# Altium schematic sheet Microcontroller.SchDoc
size A2
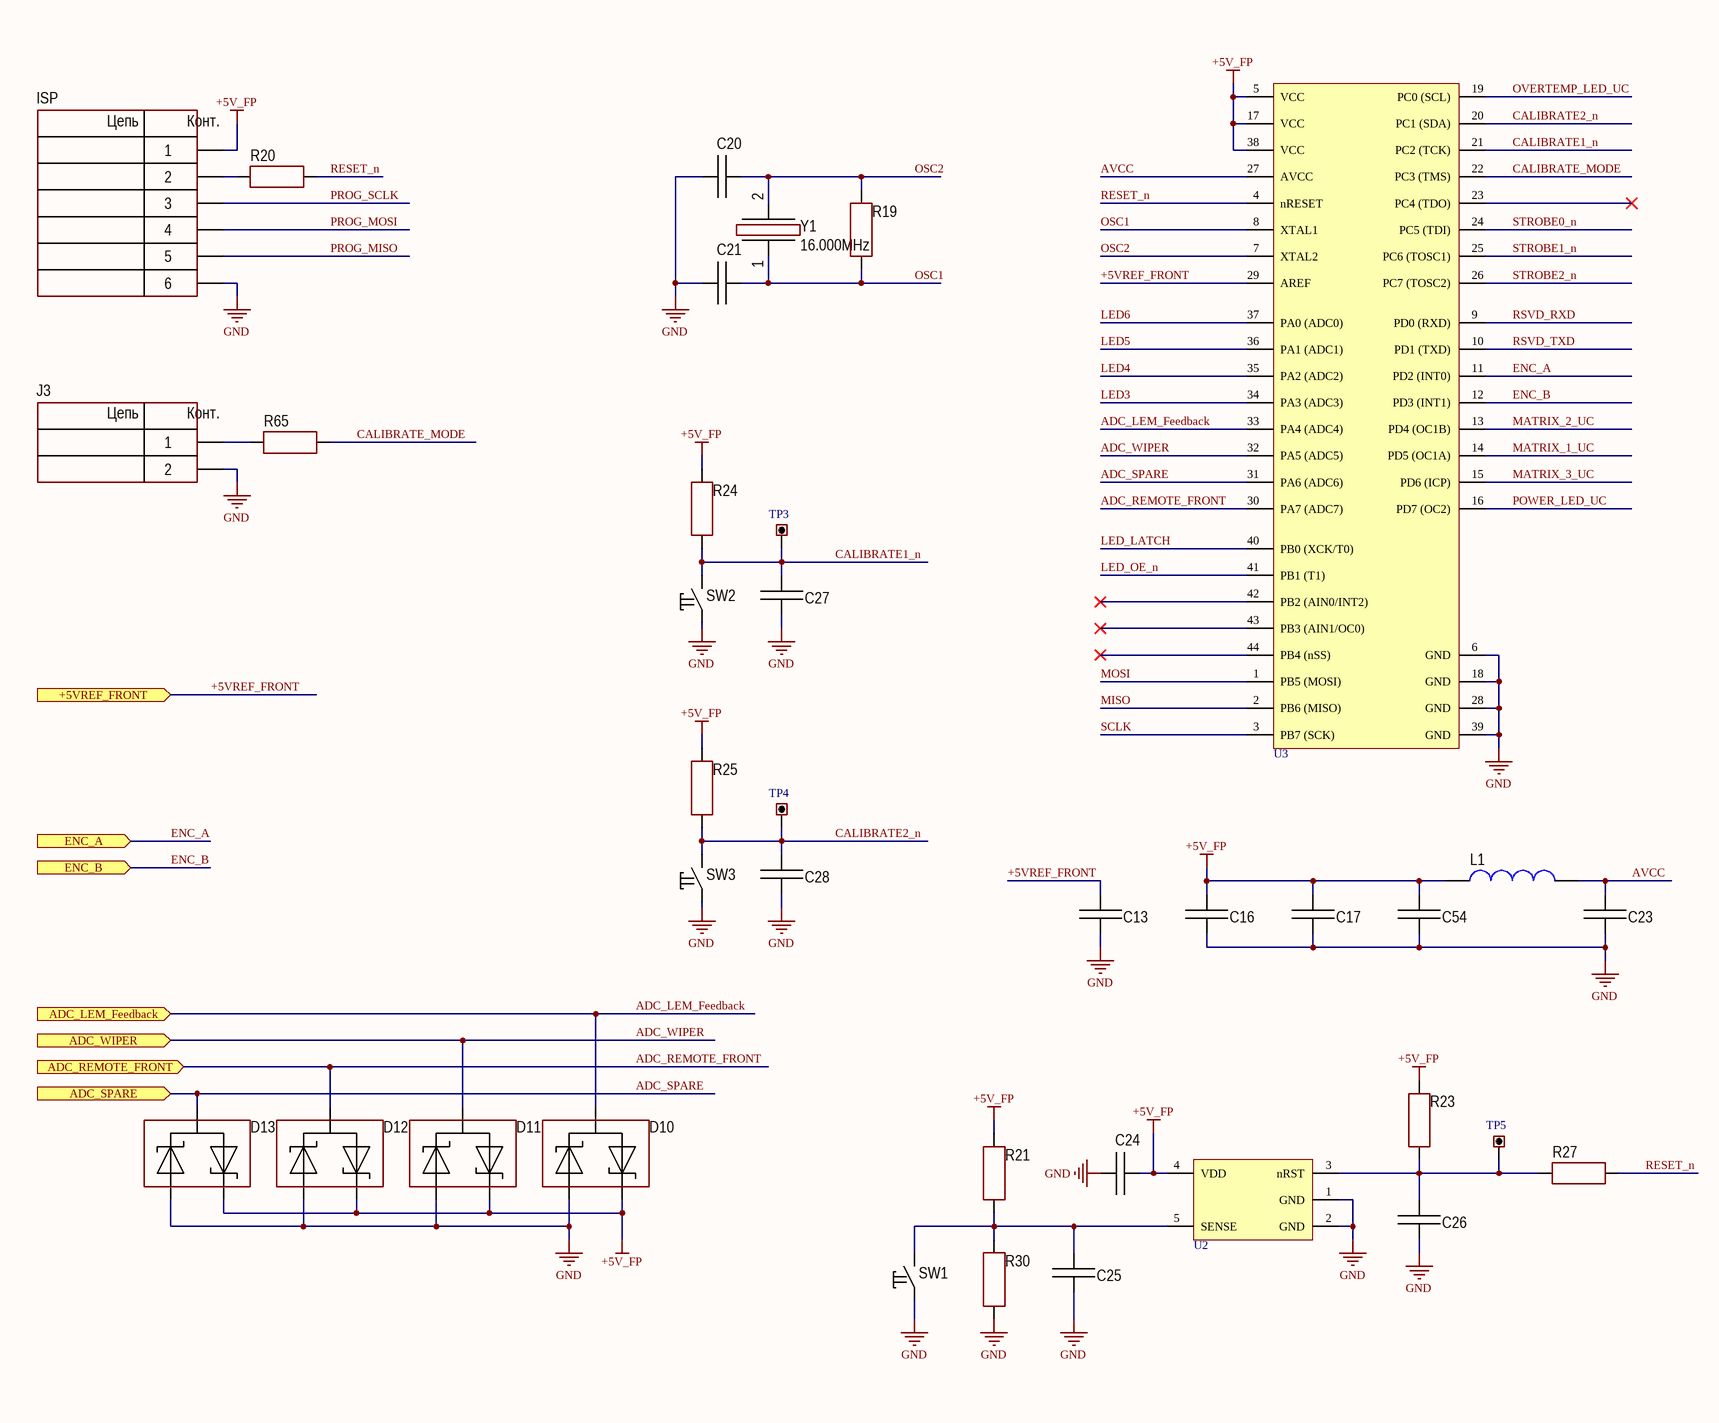
[diagram p0: Microcontroller.SchDoc, left]
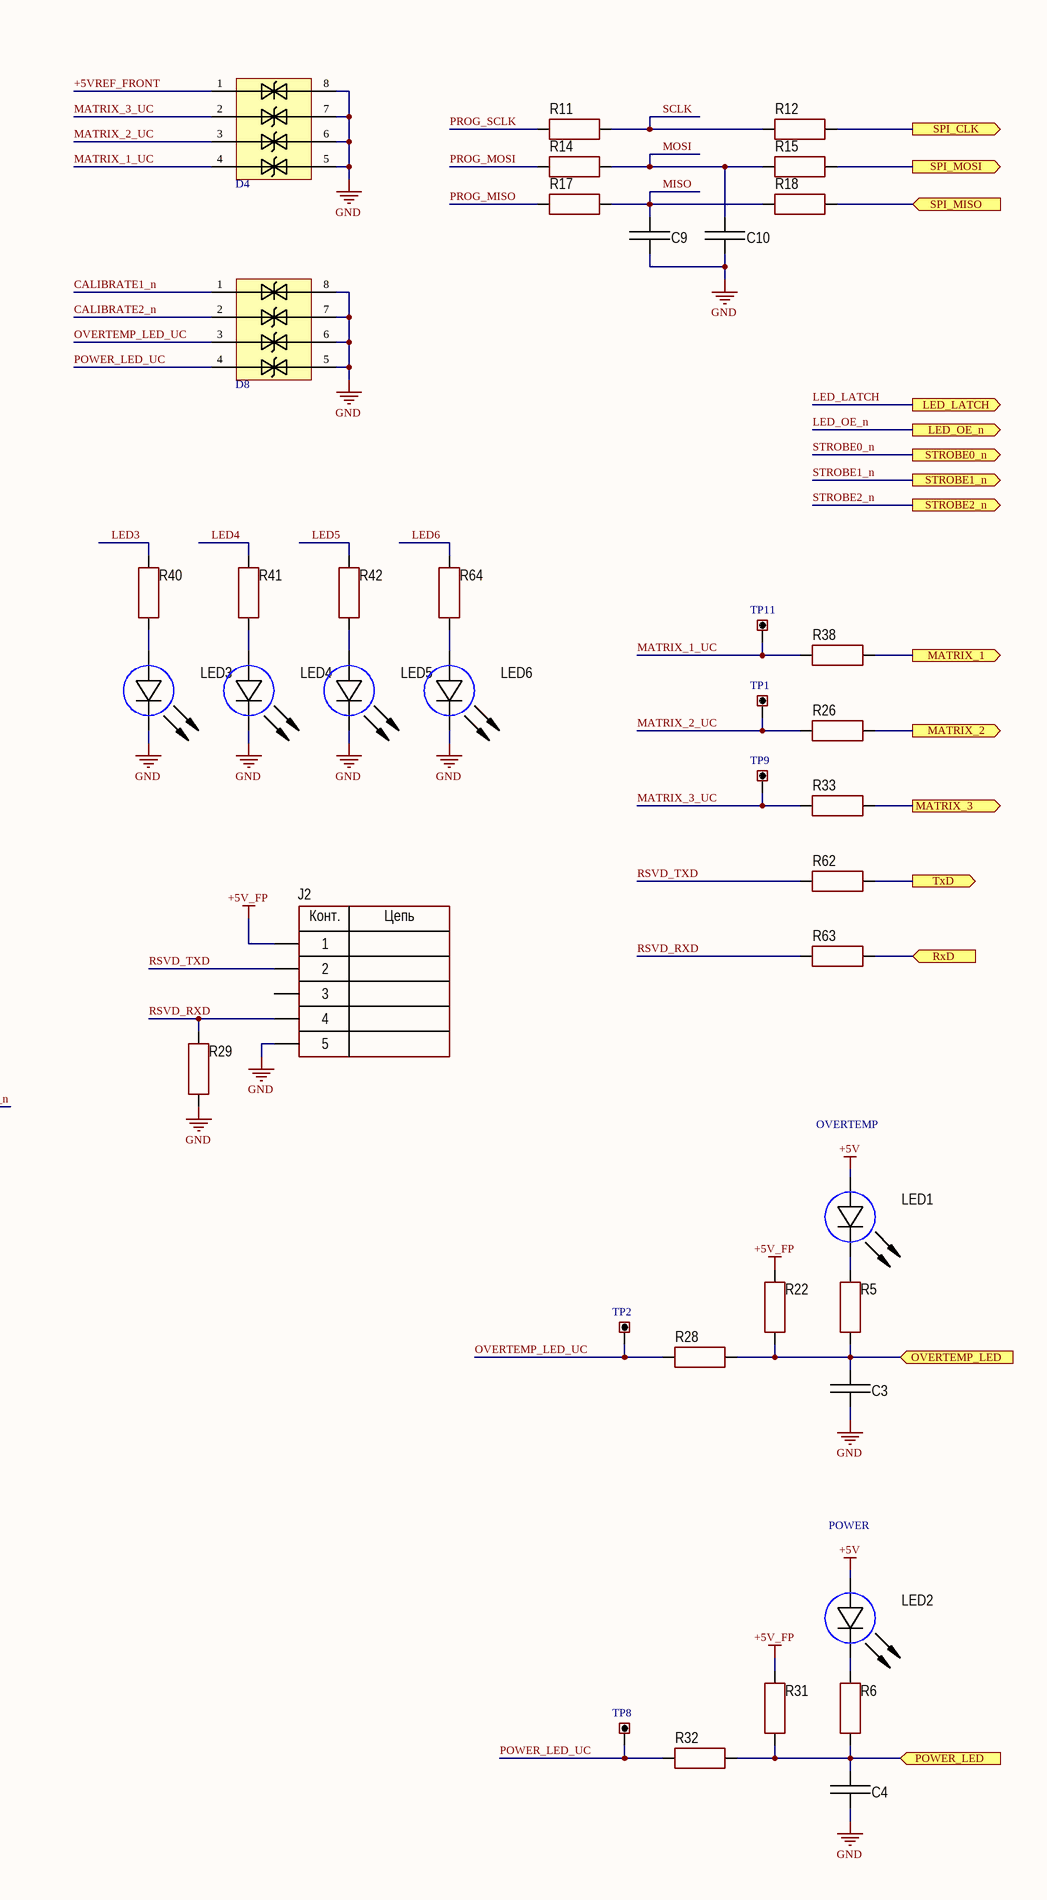
[diagram p1: Microcontroller.SchDoc, right]

## Parts
C3  (no value)  [CAP: 1206]
C4  (no value)  [CAP: 1206]
C9  (no value)  [CAP: 1206]
C10  (no value)  [CAP: 1206]
C13  (no value)  [CAP: 1206]
C16  (no value)  [CAP: 1206]
C17  (no value)  [CAP: 1206]
C20  (no value)  [CAP: 1206]
C21  (no value)  [CAP: 1206]
C23  (no value)  [CAP: 1206]
C24  (no value)  [CAP: 1206]
C25  (no value)  [CAP: 1206]
C26  (no value)  [CAP: 1206]
C27  (no value)  [CAP: 1206]
C28  (no value)  [CAP: 1206]
C54  (no value)  [CAP: 1206]
D4  (no value)  [8-SOIC]
D8  (no value)  [8-SOIC]
D10  (no value)  [SOT23]
D11  (no value)  [SOT23]
D12  (no value)  [SOT23]
D13  (no value)  [SOT23]
ISP  (no value)  [CON: PLS-6]
J2  (no value)  [CON: PLS-5]
J3  (no value)  [CON: PLS-2]
L1  (no value)  [RES: 1206]
LED1  (no value)  [DIODE: LED5MM_Y]
LED2  (no value)  [DIODE: LED5MM_G]
LED3  (no value)  [DIODE: LED5MM_G]
LED4  (no value)  [DIODE: LED5MM_G]
LED5  (no value)  [DIODE: LED5MM_G]
LED6  (no value)  [DIODE: LED5MM_G]
R5  (no value)  [RES: 1206]
R6  (no value)  [RES: 1206]
R11  (no value)  [RES: 1206]
R12  (no value)  [RES: 1206]
R14  (no value)  [RES: 1206]
R15  (no value)  [RES: 1206]
R17  (no value)  [RES: 1206]
R18  (no value)  [RES: 1206]
R19  (no value)  [RES: 1206]
R20  (no value)  [RES: 1206]
R21  (no value)  [RES: 1206]
R22  (no value)  [RES: 1206]
R23  (no value)  [RES: 1206]
R24  (no value)  [RES: 1206]
R25  (no value)  [RES: 1206]
R26  (no value)  [RES: 1206]
R27  (no value)  [RES: 1206]
R28  (no value)  [RES: 1206]
R29  (no value)  [RES: 1206]
R30  (no value)  [RES: 1206]
R31  (no value)  [RES: 1206]
R32  (no value)  [RES: 1206]
R33  (no value)  [RES: 1206]
R38  (no value)  [RES: 1206]
R40  (no value)  [RES: 1206]
R41  (no value)  [RES: 1206]
R42  (no value)  [RES: 1206]
R62  (no value)  [RES: 1206]
R63  (no value)  [RES: 1206]
R64  (no value)  [RES: 1206]
R65  (no value)  [RES: 1206]
SW1  (no value)  [DTSM-32]
SW2  (no value)  [DTSM-32]
SW3  (no value)  [DTSM-32]
TP1  Test_Point  [Test_Point]  (value not drawn)  (no BOM)
TP2  Test_Point  [Test_Point]  (value not drawn)  (no BOM)
TP3  Test_Point  [Test_Point]  (value not drawn)  (no BOM)
TP4  Test_Point  [Test_Point]  (value not drawn)  (no BOM)
TP5  Test_Point  [Test_Point]  (value not drawn)  (no BOM)
TP8  Test_Point  [Test_Point]  (value not drawn)  (no BOM)
TP9  Test_Point  [Test_Point]  (value not drawn)  (no BOM)
TP11  Test_Point  [Test_Point]  (value not drawn)  (no BOM)
U2  (no value)  [TPS3801]
U3  (no value)  [TQFP80P1200X1200X120-44L]
Y1  Frequency: 16.000MHz  [HC49SM]

## Ports
+5VREF_FRONT (in), ADC_LEM_Feedback (in), ADC_REMOTE_FRONT (in), ADC_SPARE (in), ADC_WIPER (in), ENC_A (in), ENC_B (in), LED_LATCH (out), LED_OE_n (out), MATRIX_1 (out), MATRIX_2 (out), MATRIX_3 (out), OVERTEMP_LED (in), POWER_LED (in), RxD (in), SPI_CLK (out), SPI_MISO (in), SPI_MOSI (out), STROBE0_n (out), STROBE1_n (out), STROBE2_n (out), TxD (out)

## Nets
+5V: LED1.1(A) LED2.1(A)
+5V_FP: C16.2 C17.2 C24.2 C54.2 D10.2 D11.2 D12.2 D13.2 ISP.1 J2.1 L1.2 R21.1 R22.2 R23.1 R24.1 R25.1 R31.2 U2.4(VDD) U3.5(VCC) U3.17(VCC) U3.38(VCC)
GND: C3.2 C4.2 C9.1 C10.1 C13.1 C16.1 C17.1 C20.2 C21.2 C23.1 C24.1 C25.1 C26.1 C27.1 C28.1 C54.1 D4.5 D4.6 D4.7 D4.8 D8.5 D8.6 D8.7 D8.8 D10.1 D11.1 D12.1 D13.1 ISP.6 J2.5 J3.2 LED3.2(C) LED4.2(C) LED5.2(C) LED6.2(C) R29.2 R30.2 SW1.1 SW2.1 SW3.1 U2.1(GND) U2.2(GND) U3.6(GND) U3.18(GND) U3.28(GND) U3.39(GND)
+5VREF_FRONT: C13.2 D4.1 U3.29(AREF) ; port +5VREF_FRONT
ADC_LEM_Feedback: D10.3 U3.33(PA4_(ADC4)) ; port ADC_LEM_Feedback
ADC_REMOTE_FRONT: D12.3 U3.30(PA7_(ADC7)) ; port ADC_REMOTE_FRONT
ADC_SPARE: D13.3 U3.31(PA6_(ADC6)) ; port ADC_SPARE
ADC_WIPER: D11.3 U3.32(PA5_(ADC5)) ; port ADC_WIPER
AVCC: C23.2 L1.1 U3.27(AVCC)
CALIBRATE1_n: C27.2 D8.1 R24.2 SW2.2 TP3.1 U3.21(PC2_(TCK))
CALIBRATE2_n: C28.2 D8.2 R25.2 SW3.2 TP4.1 U3.20(PC1_(SDA))
CALIBRATE_MODE: R65.1 U3.22(PC3_(TMS))
ENC_A: U3.11(PD2_(INT0)) ; port ENC_A
ENC_B: U3.12(PD3_(INT1)) ; port ENC_B
LED3: R40.2 U3.34(PA3_(ADC3))
LED4: R41.2 U3.35(PA2_(ADC2))
LED5: R42.2 U3.36(PA1_(ADC1))
LED6: R64.2 U3.37(PA0_(ADC0))
LED_LATCH: U3.40(PB0_(XCK/T0)) ; port LED_LATCH
LED_OE_n: U3.41(PB1_(T1)) ; port LED_OE_n
MATRIX_1: R38.2 ; port MATRIX_1
MATRIX_1_UC: D4.4 R38.1 TP11.1 U3.14(PD5_(OC1A))
MATRIX_2: R26.2 ; port MATRIX_2
MATRIX_2_UC: D4.3 R26.1 TP1.1 U3.13(PD4_(OC1B))
MATRIX_3: R33.2 ; port MATRIX_3
MATRIX_3_UC: D4.2 R33.1 TP9.1 U3.15(PD6_(ICP))
MISO: C9.2 R17.1 R18.2 U3.2(PB6_(MISO))
MOSI: C10.2 R14.1 R15.2 U3.1(PB5_(MOSI))
OSC1: C21.1 R19.2 U3.8(XTAL1) Y1.1
OSC2: C20.1 R19.1 U3.7(XTAL2) Y1.2
OVERTEMP_LED: C3.1 R5.1 R22.1 R28.1 ; port OVERTEMP_LED
OVERTEMP_LED_UC: D8.3 R28.2 TP2.1 U3.19(PC0_(SCL))
POWER_LED: C4.1 R6.1 R31.1 R32.2 ; port POWER_LED
POWER_LED_UC: D8.4 R32.1 TP8.1 U3.16(PD7_(OC2))
PROG_MISO: ISP.5 R17.2
PROG_MOSI: ISP.4 R14.2
PROG_SCLK: ISP.3 R11.2
RESET_n: R20.1 R27.1 U3.4(nRESET)
RSVD_RXD: J2.4 R29.1 R63.1 U3.9(PD0_(RXD))
RSVD_TXD: J2.2 R62.1 U3.10(PD1_(TXD))
RxD: R63.2 ; port RxD
SCLK: R11.1 R12.2 U3.3(PB7_(SCK))
SPI_CLK: R12.1 ; port SPI_CLK
SPI_MISO: R18.1 ; port SPI_MISO
SPI_MOSI: R15.1 ; port SPI_MOSI
STROBE0_n: U3.24(PC5_(TDI)) ; port STROBE0_n
STROBE1_n: U3.25(PC6_(TOSC1)) ; port STROBE1_n
STROBE2_n: U3.26(PC7_(TOSC2)) ; port STROBE2_n
TxD: R62.2 ; port TxD
NetC25_2: C25.2 R21.2 R30.1 SW1.2 U2.5(SENSE)
NetC26_2: C26.2 R23.2 R27.2 TP5.1 U2.3(nRST)
NetISP_2: ISP.2 R20.2
NetJ3_1: J3.1 R65.2
NetLED1_2: LED1.2(C) R5.2
NetLED2_2: LED2.2(C) R6.2
NetLED3_1: LED3.1(A) R40.1
NetLED4_1: LED4.1(A) R41.1
NetLED5_1: LED5.1(A) R42.1
NetLED6_1: LED6.1(A) R64.1

Not connected (* = marked no-connect by the designer): J2 3; U3 23(PC4_(TDO))* 42(PB2_(AIN0/INT2))* 43(PB3_(AIN1/OC0))* 44(PB4_(nSS))*

## Notes on the sheet
- OVERTEMP
- POWER
- (in symbol PBS-5) Конт.; Цепь
- (in symbol PLS-2) Цепь; Конт.
- (in symbol PLS-6) Цепь; Конт.

## Library data of the parts
C3 C4 C13 C16 C17 C26-C28 C54 = Ceramic_1206: Manufacturer: Yageo; PartNumber: CC1206KRX7R9BB104; ValueManufacturerPartNumber: Ceramic capacitor, 0.1μF, 1206; TypeCapacitor: Ceramic capacitor; Tolerance: ±10%; TypeDielectric: X7R; Voltage: 50V; Value: 0.1μF; Package: 1206; HelpURL: https://www.digikey.com/product-detail/en/yageo/CC1206KRX7R9BB104/311-1179-1-ND/303089; Temperature: -55...+125°C
C9 C10 C24 C25 = Ceramic_1206: Manufacturer: Yageo; PartNumber: CC1206KRX7R9BB104; ValueManufacturerPartNumber: Ceramic capacitor, 10nF, 1206; TypeCapacitor: Ceramic capacitor; Tolerance: ±10%; TypeDielectric: X7R; Voltage: 50V; Value: 10nF; Package: 1206; HelpURL: https://www.digikey.com/product-detail/en/yageo/CC1206KRX7R9BB104/311-1179-1-ND/303089; Temperature: -55...+125°C
C20 C21 = Ceramic_1206: Manufacturer: Yageo; PartNumber: CC1206KRX7R9BB104; ValueManufacturerPartNumber: Ceramic capacitor, 22pF, 1206; TypeCapacitor: Ceramic capacitor; Tolerance: ±10%; TypeDielectric: X7R; Voltage: 50V; Value: 22pF; Package: 1206; HelpURL: https://www.digikey.com/product-detail/en/yageo/CC1206KRX7R9BB104/311-1179-1-ND/303089; Temperature: -55...+125°C
C23 = Ceramic_1206: Manufacturer: Yageo; PartNumber: CC1206KRX7R9BB104; ValueManufacturerPartNumber: Ceramic capacitor, 1.0μF, 1206; TypeCapacitor: Ceramic capacitor; Tolerance: ±10%; TypeDielectric: X7R; Voltage: 50V; Value: 1.0μF; Package: 1206; HelpURL: https://www.digikey.com/product-detail/en/yageo/CC1206KRX7R9BB104/311-1179-1-ND/303089; Temperature: -55...+125°C
D4 D8 = CDNBS08-T05C: ValueManufacturerPartNumber: CDNBS08-T05C, SOIC-8; Package: SOIC-8; PartNumber: CDNBS08-T05C
D10-D13 = Schottky_array: Manufacturer: Diodes Incorporated; ValueManufacturerPartNumber: BAS40-04, SOT23-3; PartNumber: BAS40-04; TypeDiode: Schottky array; Voltage: 40V; Current: 120mA; VoltageDrop: 1V; RecoveryTime: 15pF; Package: SOT23-3; HelpURL: https://www.digikey.com/product-detail/en/diodes-incorporated/MBR0580S1-7/MBR0580S1-7DICT-ND/5080371; Temperature: -55...+150°C
ISP = PLS-6: Manufacturer: Connfly; ValueManufacturerPartNumber: Connector, PLS-6, 6 pin; TypeConnector: Connector; VoltageMax: 500VAC; Pitch: 2.54mm; CurrentMax: 3A; Multichannel: 6 pin; CommentText: "Разъем"; HelpURL: https://www.chipdip.ru/product/pls-6; PartNumber: PLS-6
J2 = PBS-5: Manufacturer: Connfly; ValueManufacturerPartNumber: Connector, PBS-5, 5 pin; TypeConnector: Connector; VoltageMax: 500VAC; Pitch: 2.54mm; CurrentMax: 3A; Multichannel: 5 pin; CommentText: "Разъем"; HelpURL: https://www.chipdip.ru/product/pbs-5; PartNumber: PBS-5
J3 = PLS-2: Manufacturer: Connfly; ValueManufacturerPartNumber: PLS-2, 2pin; TypeConnector: Connector; VoltageMax: 500VAC; Pitch: 2.54mm; CurrentMax: 3A; Multichannel: 2pin; CommentText: "Разъем"; HelpURL: https://www.chipdip.ru/product/pls-2; PartNumber: PLS-2
L1 = Inductor_0805: Manufacturer: Murata Electronics; PartNumber: LQM21FN100M70L; ValueManufacturerPartNumber: Fixed inductor, 100μH, 1206; TypeInductor: Fixed inductor; MaxCurrent: 100mA; Tolerance: ±20%; Value: 100μH; Package: 1206; HelpURL: https://www.digikey.com/product-detail/en/murata-electronics-north-america/LQM21FN100M70L/490-4029-1-ND/1016289; Temperature: -55...+125°C
LED1 = LED_single: ValueManufacturerPartNumber: LED, YELLOW, 5 mm; TypeDiode: LED; ColorParameter: YELLOW; Manufacturer: *; Package: 5 mm; HelpURL: *; Temperature: -55...+150°C; Current: *; VoltageDrop: *; PartNumber: *; Color: YELLOW
LED2 = LED_single: ValueManufacturerPartNumber: LED, BLUE, 5 mm; TypeDiode: LED; ColorParameter: BLUE; Manufacturer: *; Package: 5 mm; HelpURL: *; Temperature: -55...+150°C; Current: *; VoltageDrop: *; PartNumber: *; Color: BLUE
LED3-LED6 = LED_single: ValueManufacturerPartNumber: LED, GREEN, 5 mm; TypeDiode: LED; ColorParameter: GREEN; Manufacturer: *; Package: 5 mm; HelpURL: *; Temperature: -55...+150°C; Current: *; VoltageDrop: *; PartNumber: *; Color: GREEN
R5 R6 R40-R42 R64 = Resistor_1206: Manufacturer: Yageo; PartNumber: RC1206JR-07100RL; ValueManufacturerPartNumber: Resistor, 2K, 1206; Power: 0.25W; Tolerance: ±5%; Value: 2K; Package: 1206; HelpURL: https://www.digikey.com/product-detail/en/yageo/RC1206JR-07100RL/311-100ERCT-ND/732153; Temperature: -55...+125°C; TypeResistor: Resistor
R11 R12 R14 R15 R17 R18 R20 R27 = Resistor_1206: Manufacturer: Yageo; PartNumber: RC1206JR-07100RL; ValueManufacturerPartNumber: Resistor, 47R, 1206; Power: 0.25W; Tolerance: ±5%; Value: 47R; Package: 1206; HelpURL: https://www.digikey.com/product-detail/en/yageo/RC1206JR-07100RL/311-100ERCT-ND/732153; Temperature: -55...+125°C; TypeResistor: Resistor
R19 = Resistor_1206: Manufacturer: Yageo; PartNumber: RC1206JR-07100RL; ValueManufacturerPartNumber: Resistor, 1M, 1206; Power: 0.25W; Tolerance: ±5%; Value: 1M; Package: 1206; HelpURL: https://www.digikey.com/product-detail/en/yageo/RC1206JR-07100RL/311-100ERCT-ND/732153; Temperature: -55...+125°C; TypeResistor: Resistor
R21-R25 R29 R31 = Resistor_1206: Manufacturer: Yageo; PartNumber: RC1206JR-07100RL; ValueManufacturerPartNumber: Resistor, 10K, 1206; Power: 0.25W; Tolerance: ±5%; Value: 10K; Package: 1206; HelpURL: https://www.digikey.com/product-detail/en/yageo/RC1206JR-07100RL/311-100ERCT-ND/732153; Temperature: -55...+125°C; TypeResistor: Resistor
R26 R28 R32 R33 R38 R62 R63 R65 = Resistor_1206: Manufacturer: Yageo; PartNumber: RC1206JR-07100RL; ValueManufacturerPartNumber: Resistor, 1K, 1206; Power: 0.25W; Tolerance: ±5%; Value: 1K; Package: 1206; HelpURL: https://www.digikey.com/product-detail/en/yageo/RC1206JR-07100RL/311-100ERCT-ND/732153; Temperature: -55...+125°C; TypeResistor: Resistor
R30 = Resistor_1206: Manufacturer: Yageo; PartNumber: RC1206JR-07100RL; ValueManufacturerPartNumber: Resistor, 4.32K, 1206; Power: 0.25W; Tolerance: ±5%; Value: 4.32K; Package: 1206; HelpURL: https://www.digikey.com/product-detail/en/yageo/RC1206JR-07100RL/311-100ERCT-ND/732153; Temperature: -55...+125°C; TypeResistor: Resistor
SW1-SW3 = Button_tactile: Manufacturer: TE Connectivity; ValueManufacturerPartNumber: Tactile button, DTSM-32; TypeButton: Tactile button; CommentText: "Кнопка"; HelpURL: https://www.digikey.com/product-detail/en/te-connectivity-alcoswitch-switches/FSM2JSMAATR/450-1792-1-ND/3503931; PartNumber: DTSM-32; Package: 6x6mm
U2 = TPS3801: ValueManufacturerPartNumber: TPS3801, SOT23-5; Package: SOT23-5; PartNumber: TPS3801
U3 = ATMega16-16AU: ValueManufacturerPartNumber: ATMega16-16AU, TQFP-44; Package: TQFP-44; PartNumber: ATMega16-16AU
Y1 = Crystal_3215: Manufacturer: Epson; PartNumber: HC49SM-16.000MHZ-20PF; ValueManufacturerPartNumber: HC49SM-16.000MHZ-20PF, HC49SM; LoadCapacitance: 12.5pF; Tolerance: ±20ppm; Package: HC49SM; HelpURL: https://www.digikey.com/product-detail/en/epson/FC-135-32.7680KA-A5/SER4103CT-ND/6188447; Temperature: -40...+85°C; TypeOscilator: Crystal